# EasyEDA schematic SCH_arduinomotor_2024-02-12.json
TITLE: Sheet_1; REV: 1.0; Date: 2024-02-09; Sheet: 1/1; Drawn By: jessebetea; Company: Your Company
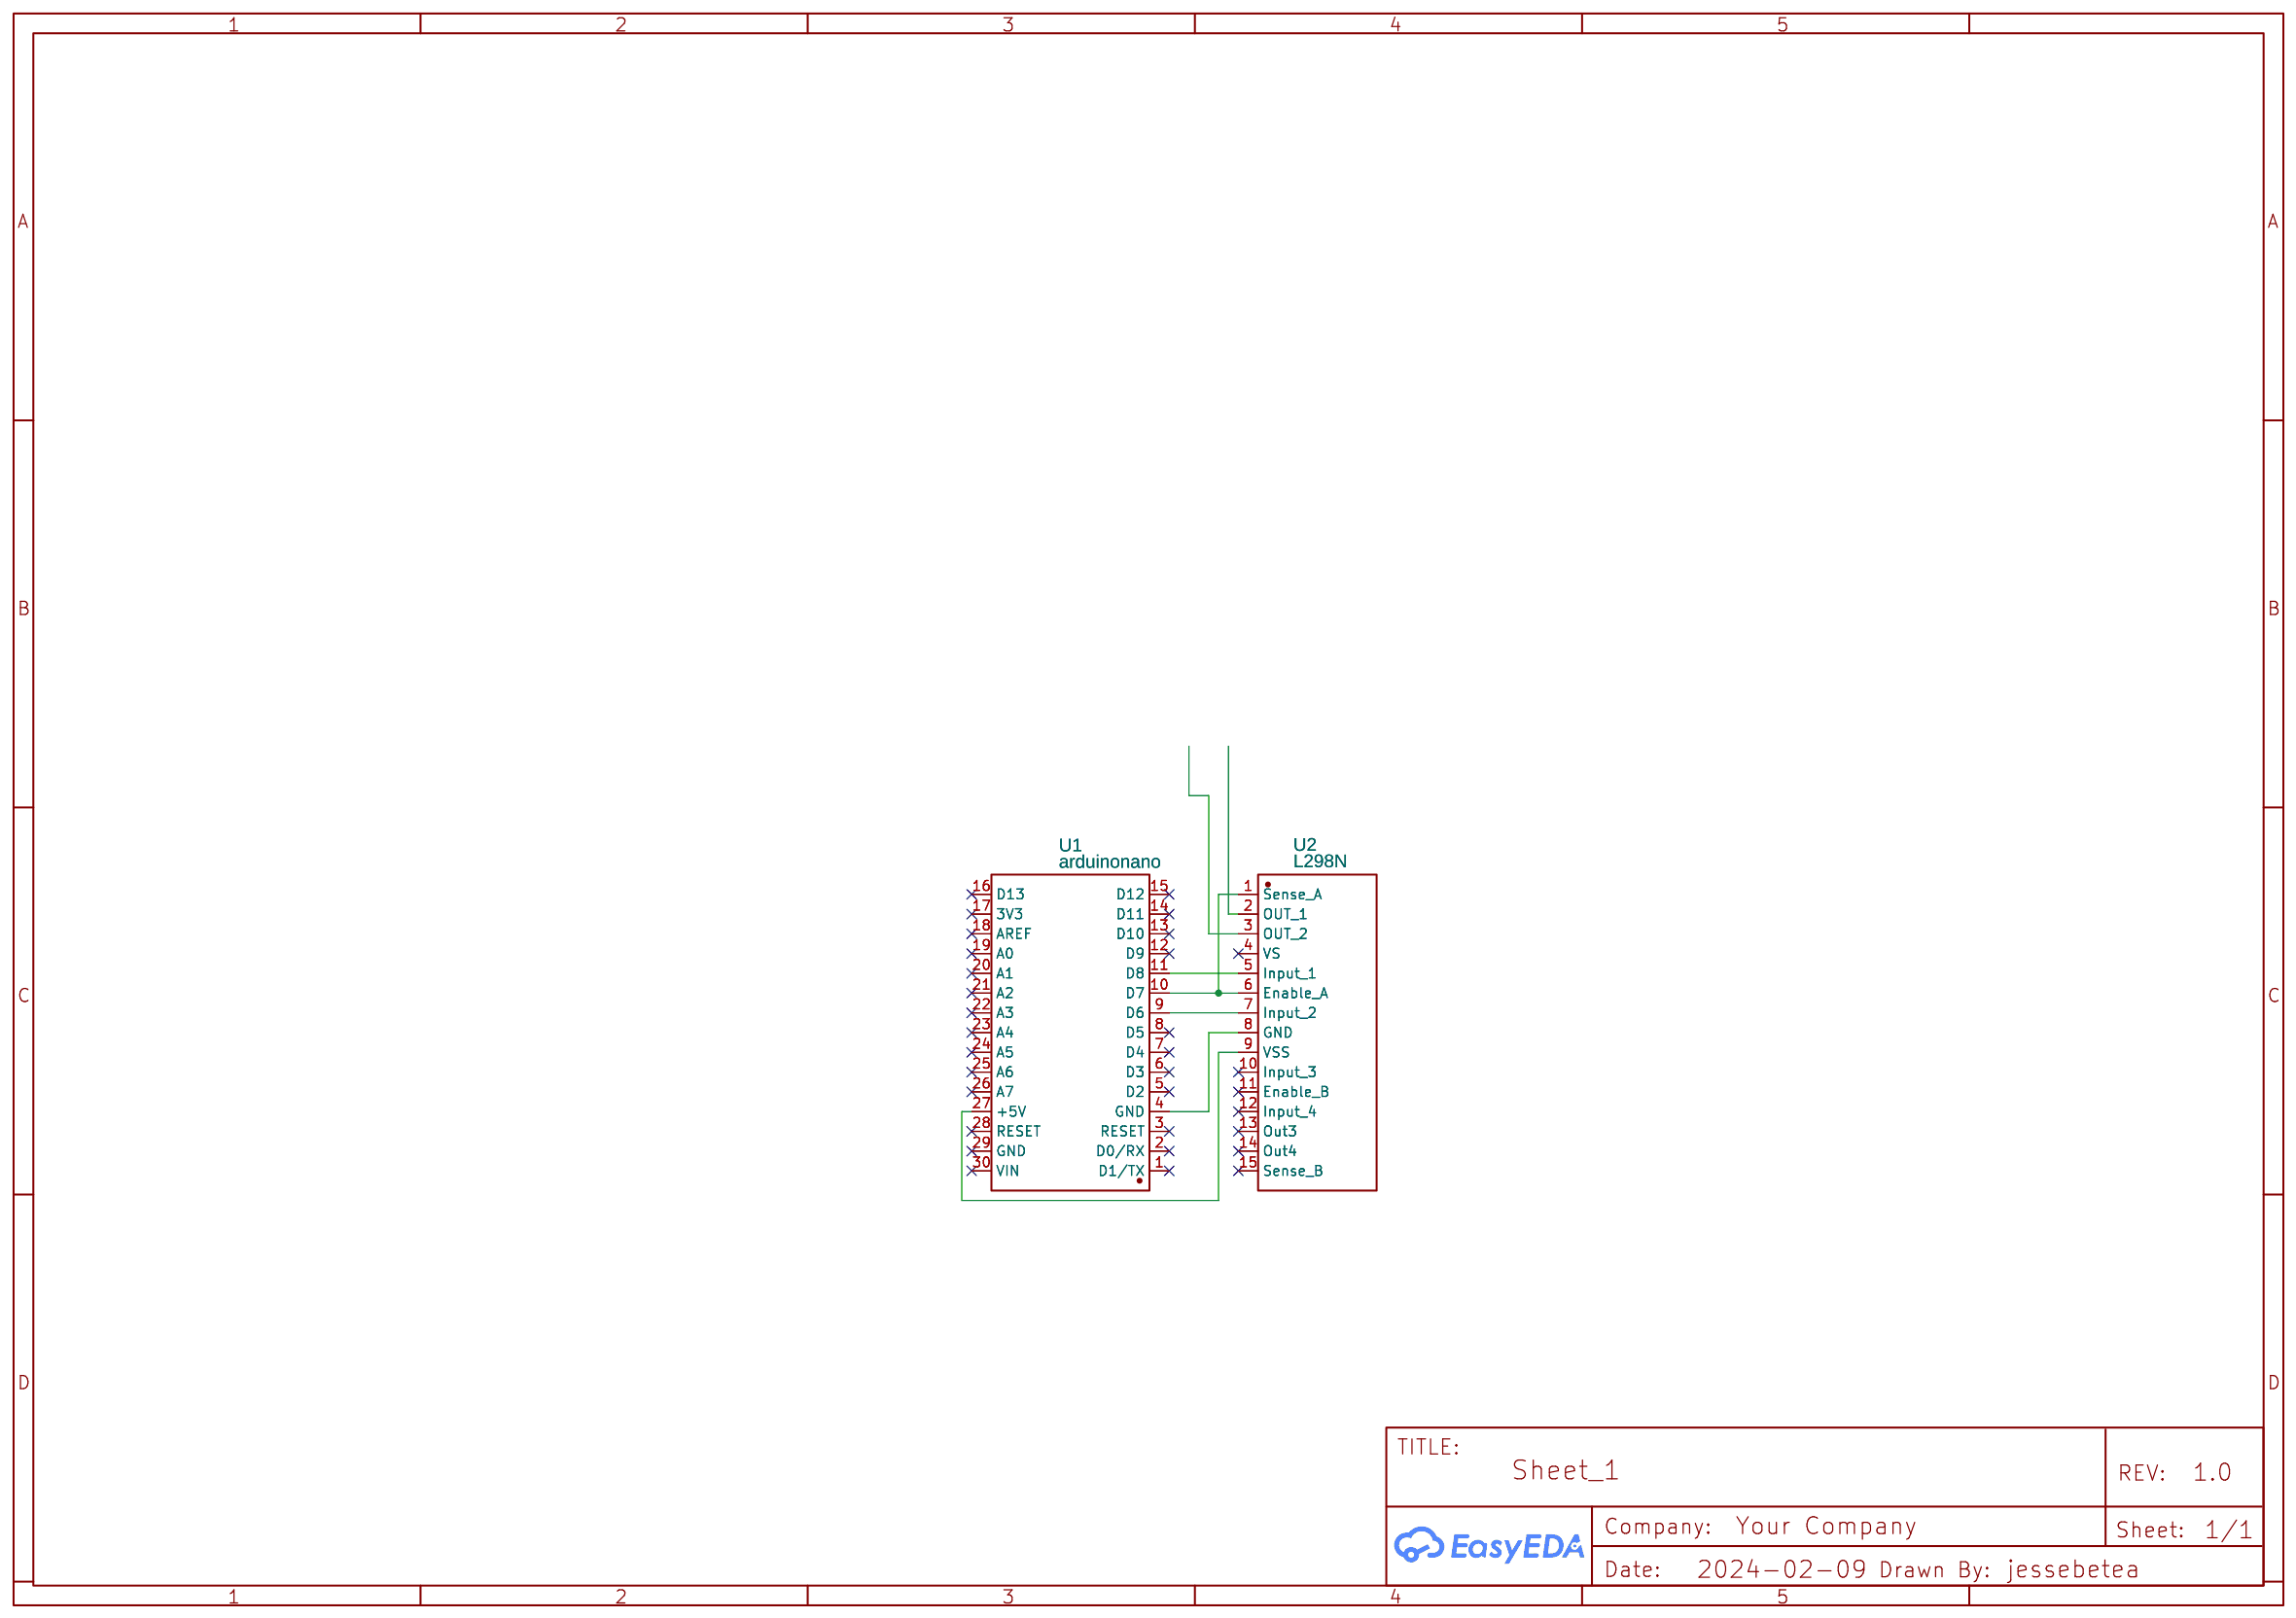
[diagram p0: schematic sheet]

## Parts
U1  arduinonano  [COMM-TH_ARDUINO_NANO]
U2  L298N  [MULTIWATT-15_L19.6-W5.0-P1.27-L]

## Library data of the parts
U1 = ARDUINO_NANO: Contributor: lcsc; Supplier: LCSC; Supplier Part: C9900017879; Manufacturer: null; JLCPCB Part Class: Extended Part
U2 = L298N: Contributor: LCSC; Supplier: LCSC; Supplier Part: C434589; Manufacturer: HGSEMI(华冠); JLCPCB Part Class: Extended Part

## Nets
Net-(U1-4): U1.4(GND) U2.8(GND)
Net-(U1-9): U1.9(D6) U2.7(Input 2)
Net-(U1-10): U1.10(D7) U2.1(Sense A) U2.6(Enable A)
Net-(U1-11): U1.11(D8) U2.5(Input 1)
Net-(U1-27): U1.27(+5V) U2.9(VSS)

Not connected (* = marked no-connect by the designer): U1 1(D1/TX)* 2(D0/RX)* 3(RESET)* 5(D2)* 6(D3)* 7(D4)* 8(D5)* 12(D9)* 13(D10)* 14(D11)* 15(D12)* 16(D13)* 17(3V3)* 18(AREF)* 19(A0)* 20(A1)* 21(A2)* 22(A3)* 23(A4)* 24(A5)* 25(A6)* 26(A7)* 28(RESET)* 29(GND)* 30(VIN)*; U2 2(OUT 1) 3(OUT 2) 4(VS)* 10(Input 3)* 11(Enable B)* 12(Input 4)* 13(Out3)* 14(Out4)* 15(Sense B)*
